# Altium schematic sheet Sheet1.SchDoc
size Letter
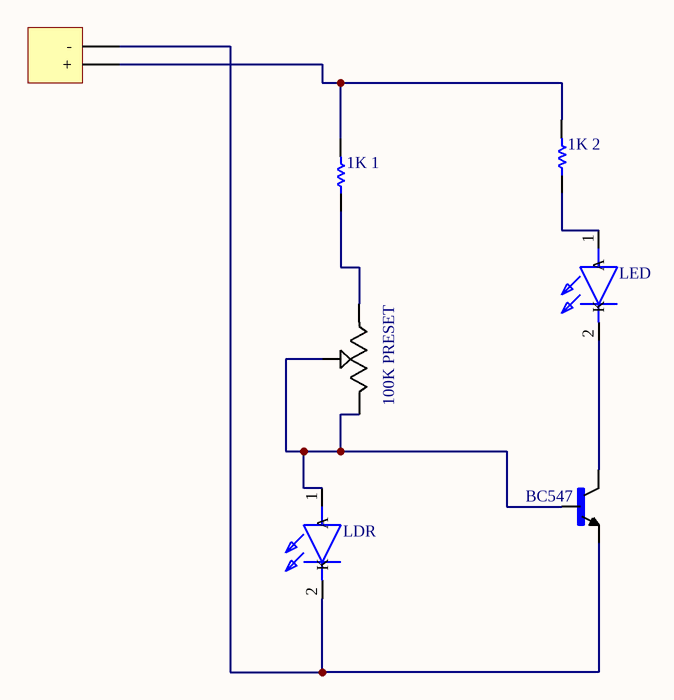
[diagram p0: Sheet1.SchDoc]

## Parts
1K_1  Res1  [AXIAL-0.3]  (value not drawn)
1K_2  Res1  [AXIAL-0.3]  (value not drawn)
100K_PRESET  (no value)  [*TRIM_EVN-D8AA03B14]
BC547  BC547*  [*TO92]  (value not drawn)
LDR  L-53GD  [L-53GD]  (value not drawn)
LED  L-53GD  [L-53GD]  (value not drawn)
P1  Header 2  [HDR1X2]  (value not drawn)

## Nets
Net1K_1_1: 1K_1.1 100K_PRESET.1
Net1K_1_2: 1K_1.2 1K_2.2 P1.1(+)
Net1K_2_1: 1K_2.1 LED.1(A)
Net100K_PRESET_2: 100K_PRESET.2 100K_PRESET.3 BC547.2(B) LDR.1(A)
NetBC547_1: BC547.1(C) LED.2(K)
NetBC547_3: BC547.3(E) LDR.2(K) P1.2(-)

## Library data of the parts
1K_1 1K_2 = Res1: Resistor; Value: 1K; Published: 8-Jun-2000; LatestRevisionDate: 17-Jul-2002; LatestRevisionNote: Re-released for DXP Platform.; PackageReference: AXIAL-0.3; Publisher: Altium Limited; PackageDescription: Axial Device, Thru-Hole; 2 Leads; 0.3 in Pin Spacing
100K_PRESET = EVN-D8AA03B14: Trimmer; Carbon; Rest 10 Kilohms; PCB; 1 Turn; Pwr-Rtg 0.1 W; Linear; Top Adj; 6 mm SQ; MF: Panasonic Electronic; Availability: Unavailable; Price: None; SnapEDA_Link: https://www.snapeda.com/parts/EVN-D8AA03B14/Panasonic%20Electronic%20Components/view-part/?ref=snap; MP: EVN-D8AA03B14; Package: PQFP-44 Panasonic; Value: *
BC547 = BC547*: Transistor NPN BC547 PHILIPS miliampere=100 TO92; MF: ON Semiconductor; MP: BC547; Price: None; Package: TO-92 ON Semiconductor; Availability: Unavailable; SnapEDA_Link: https://www.snapeda.com/parts/BC547/ON%20Semiconductor/view-part/?ref=snap; Value: *
LDR LED = L-53GD: LED; Manufacturer_Name: Kingbright; Allied_Number: 70424261; Datasheet Link: http://docs-emea.rs-online.com/webdocs/151e/0900766b8151e408.pdf; Manufacturer_Part_Number: L-53GD; Mouser Part Number: N/A; Mouser Price/Stock: https://www.mouser.com/Search/Refine.aspx?Keyword=N%2FA; RS Part Number: 2286004A; RS Price/Stock: http://uk.rs-online.com/web/p/products/2286004A; Allied Price/Stock: http://www.alliedelec.com/kingbright-l-53gd/70424261/
P1 = Header 2: Header, 2-Pin; LatestRevisionDate: 17-Jul-2002; LatestRevisionNote: Re-released for DXP Platform.; Publisher: Altium Limited